# Altium schematic sheet STM32.SchDoc
size A; SheetNumber: 4; SheetTotal: 6
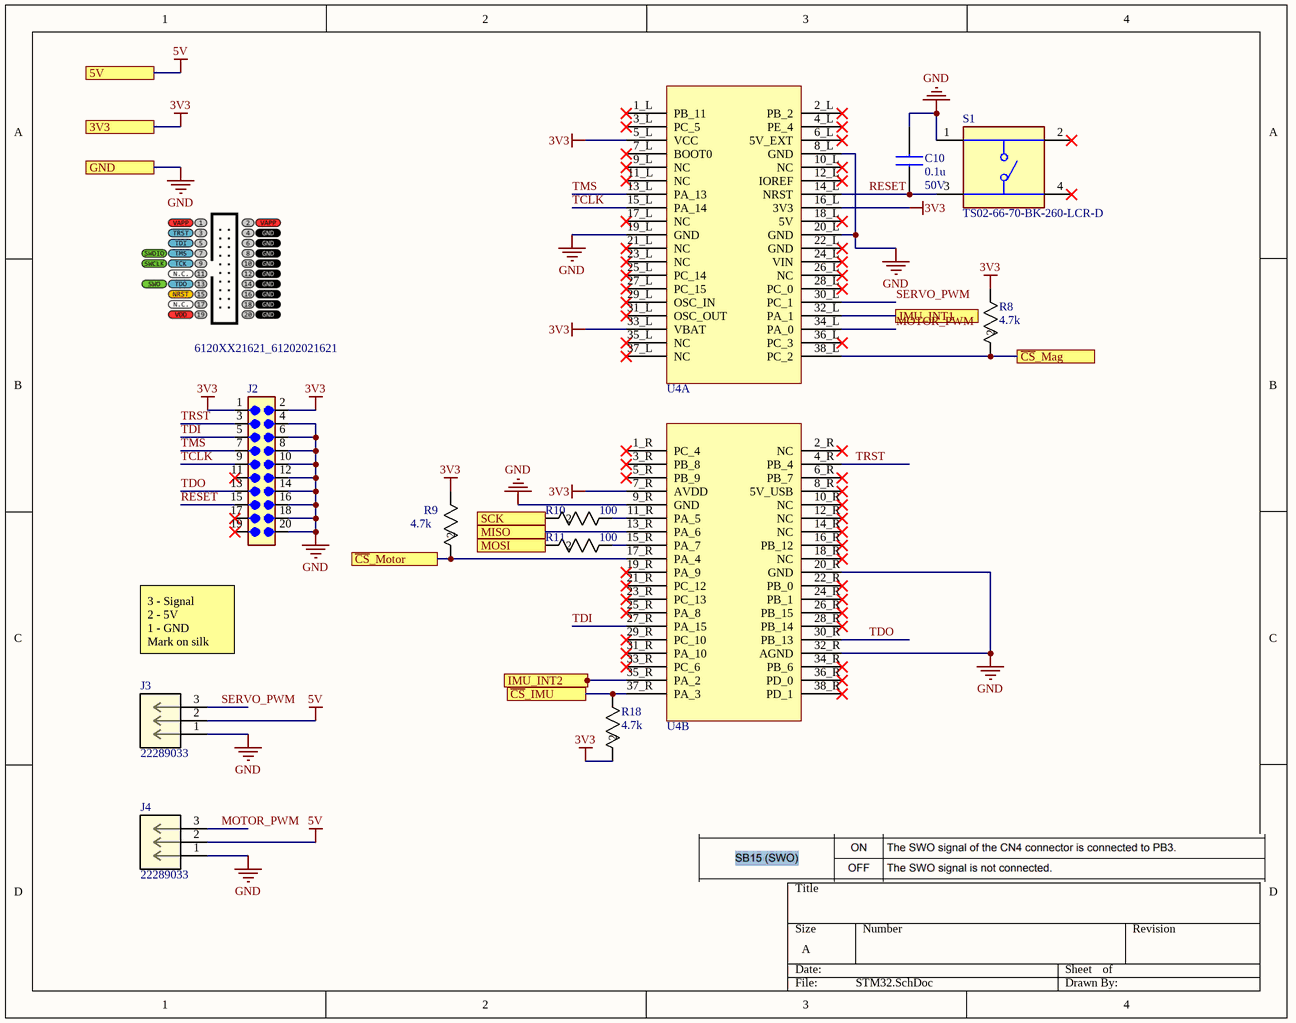
[diagram p0: STM32.SchDoc]

## Parts
C10  value 0.1u  Rated Voltage: 50V  [CAPC2012X145N]  (hidden comment: KAM21BR71H104JM)
J2  6120XX21621_61202021621  [61202021621]
J3  22289033  [CONN03_22289033_MOL]
J4  22289033  [CONN03_22289033_MOL]
R8  value 4.7k  [RC0805N_YAG]  (hidden comment: RC0805JR-074K7L)
R9  value 4.7k  [RC0805N_YAG]  (hidden comment: RC0805JR-074K7L)
R10  value 100  [RC0805N_YAG]  (hidden comment: RC0805JR-07100RL)
R11  value 100  [RC0805N_YAG]  (hidden comment: RC0805JR-07100RL)
R18  value 4.7k  [RC0805N_YAG]  (hidden comment: RC0805JR-074K7L)
S1  TS02-66-70-BK-260-LCR-D  [SW_TS02-66-70-BK-260-LCR-D]
U4  STM32_WB55  [PCBComponent_1]  (value not drawn)  (parts A,B of 2)

## Ports
3V3, 5V, GND, IMU_INT1, IMU_INT2, MISO, MOSI, SCK, ~{CS}_IMU, ~{CS}_Mag, ~{CS}_Motor

## Nets
3V3: J2.1 J2.2 R8.1 R9.1 R18.2 U4.5_L(VCC) U4.7_R(AVDD) U4.16_L(3V3) U4.33_L(VBAT) ; port 3V3
5V: J3.2 J4.2 ; port 5V
GND: C10.2 J2.4 J2.6 J2.8 J2.10 J2.12 J2.14 J2.16 J2.18 J2.20 J3.1 J4.1 S1.1 U4.8_L(GND) U4.9_R(GND) U4.19_L(GND) U4.20_L(GND) U4.20_R(GND) U4.32_R(AGND) ; port GND
~{CS}_IMU: R18.1 U4.37_R(PA_3) ; port ~{CS}_IMU
~{CS}_Mag: R8.2 U4.38_L(PC_2) ; port ~{CS}_Mag
~{CS}_Motor: R9.2 U4.17_R(PA_4) ; port ~{CS}_Motor
IMU_INT1: U4.32_L(PA_1) ; port IMU_INT1
IMU_INT2: U4.35_R(PA_2) ; port IMU_INT2
MISO: U4.13_R(PA_6) ; port MISO
MOSI: R11.2 ; port MOSI
MOTOR_PWM: J4.3 U4.34_L(PA_0)
RESET: C10.1 J2.15 S1.3 U4.14_L(NRST)
SCK: R10.2 ; port SCK
SERVO_PWM: J3.3 U4.30_L(PC_1)
TCLK: J2.9 U4.15_L(PA_14)
TDI: J2.5 U4.27_R(PA_15)
TDO: J2.13 U4.30_R(PB_13)
TMS: J2.7 U4.13_L(PA_13)
TRST: J2.3 U4.4_R(PB_4)
NetR10_1: R10.1 U4.11_R(PA_5)
NetR11_1: R11.1 U4.15_R(PA_7)

Not connected (* = marked no-connect by the designer): J2 11* 17* 19*; S1 2* 4*; U4 1_L(PB_11)* 1_R(PC_4)* 2_L(PB_2)* 2_R(NC)* 3_L(PC_5)* 3_R(PB_8)* 4_L(PE_4)* 5_R(PB_9)* 6_L(5V_EXT)* 6_R(PB_7)* 7_L(BOOT0)* 8_R(5V_USB)* 9_L(NC)* 10_L(NC)* 10_R(NC)* 11_L(NC)* 12_L(IOREF)* 12_R(NC)* 14_R(NC)* 16_R(PB_12)* 17_L(NC)* 18_L(5V)* 18_R(NC)* 19_R(PA_9)* 21_L(NC)* 21_R(PC_12)* 22_L(GND)* 22_R(PB_0)* 23_L(NC)* 23_R(PC_13)* 24_L(VIN)* 24_R(PB_1)* 25_L(PC_14)* 25_R(PA_8)* 26_L(NC)* 26_R(PB_15)* 27_L(PC_15)* 28_L(PC_0)* 28_R(PB_14)* 29_L(OSC_IN)* 29_R(PC_10)* 31_L(OSC_OUT)* 31_R(PA_10)* 33_R(PC_6)* 34_R(PB_6)* 35_L(NC)* 36_L(PC_3)* 36_R(PD_0)* 37_L(NC)* 38_R(PD_1)*

## Notes on the sheet
- 3 - Signal
  2 - 5V
  1 - GND
  Mark on silk

## Library data of the parts
C10 = KAM21BR71H104JM: Multilayer Ceramic Chip Capacitors, Capacitance=0.1u; Manufacturer_Part_Number: KAM21BR71H104JM
J2 = 6120XX21621_61202021621: MF: {'manufacturer': u'W\xfcrth Elektronik'}; Package: None; Price: None; Value: *; MP: 61202021621; Availability: Unavailable
J3 J4 = 22289033: KK 254 Breakaway Header, Right-Angle Surface Mount Compatible, 3 Circuits, 0.38Âµm Gold (Au) Selective Plating, Mating Pin Length 8.23mm, with Kinked PC Tails; Manufacturer_Name: Molex Connector Corporation; Copyright: Copyright (C) 2025 Ultra Librarian. All rights reserved.; Manufacturer_Part_Number: 22289033; Datasheet: https://www.molex.com/en-us/products/part-detail-pdf/22289033?display=pdf; RefDes: RefDes; Type: Type
R8 R9 R18 = RC0805JR-074K7L: RES 0805 4.7k 5% 1/8W; Manufacturer_Name: Yageo; Manufacturer_Part_Number: RC0805JR-074K7L; Tolerance: 5%
R10 R11 = RC0805JR-07100RL: RES 0805 100 5% 1/8W; Manufacturer_Name: Yageo; Manufacturer_Part_Number: RC0805JR-07100RL; Tolerance: 5%
S1 = TS02-66-70-BK-260-LCR-D: 6 x 6 mm, 7 mm Actuator Height, 260 gf, Black, Long Crimped, Through Hole, SPST, Tactile Switch; MF: Same Sky; SnapEDA_Link: https://www.snapeda.com/parts/TS02-66-70-BK-260-LCR-D/Same+Sky/view-part/?ref=snap; Package: None; Value: *; MP: TS02-66-70-BK-260-LCR-D; Check_prices: https://www.snapeda.com/parts/TS02-66-70-BK-260-LCR-D/Same+Sky/view-part/?ref=eda